# EAGLE design Myduino (EAGLE 7.2.0)
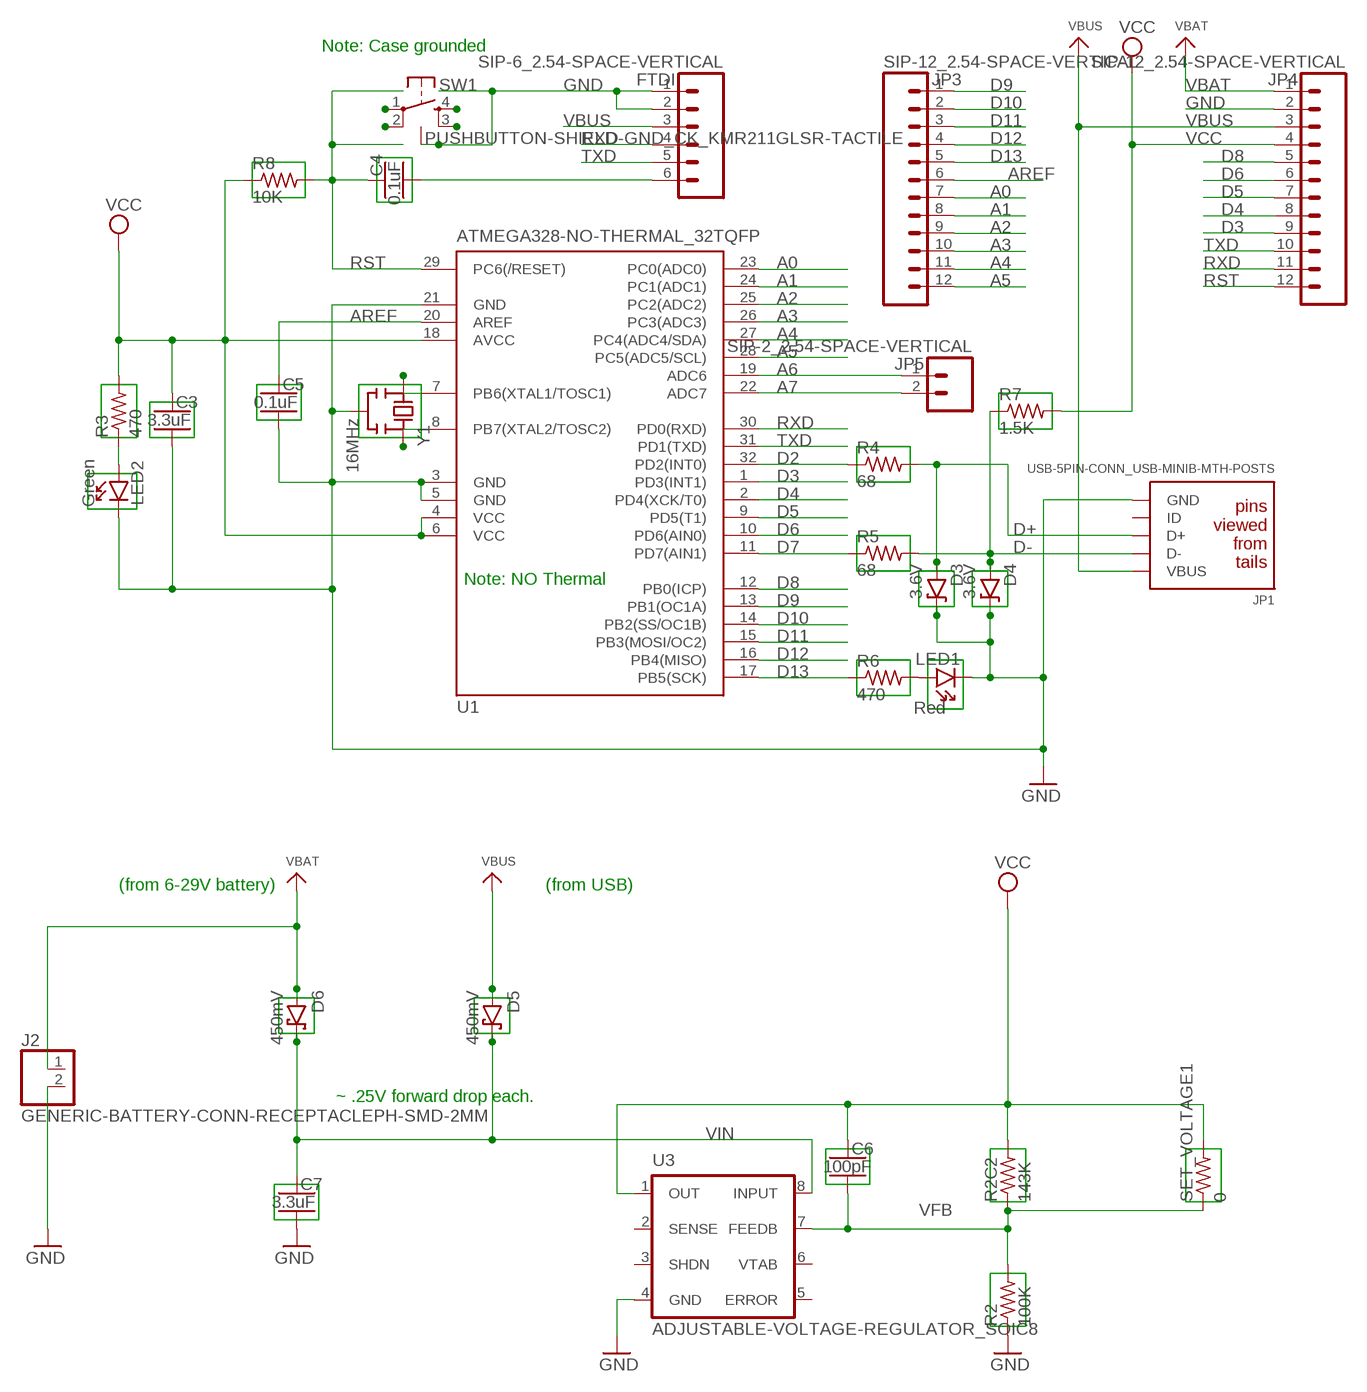
[diagram p0: schematic, sheet 1]

## Parts
C3  3.3uF  RESOLVED-CAPACITOR-NP_SMD-2012-0805_CERAMIC  [CAPC2012X140_HS]
C4  0.1uF  RESOLVED-CAPACITOR-NP_TH-FK26_CERAMIC  [CAPRB500W53L600T350H600_HS]
C5  0.1uF  RESOLVED-CAPACITOR-NP_TH-FK26_CERAMIC  [CAPRB500W53L600T350H600_HS]
C6  100pF  RESOLVED-CAPACITOR-NP_TH-FK24-FK28_CERAMIC  [CAPRB500W53L550T250H550_HS]
C7  3.3uF  RESOLVED-CAPACITOR-NP_SMD-2012-0805_CERAMIC  [CAPC2012X140_HS]
D3  3.6V  RESOLVED-DIODE-ZENER_TH-T18  [DIOAD1660W102L890D370_HS]
D4  3.6V  RESOLVED-DIODE-ZENER_TH-T18  [DIOAD1660W102L890D370_HS]
D5  450mV  RESOLVED-DIODE-SCHOTTKY_TH-DO-41-AND-DO-204AL  [DIOAD1125W78L520D270_HS]
D6  450mV  RESOLVED-DIODE-SCHOTTKY_TH-DO-41-AND-DO-204AL  [DIOAD1125W78L520D270_HS]
FTDI  SIP-6_2.54-SPACE-VERTICAL  [HDRV6W63P254_6X1_1524X254H838]
J2  GENERIC-BATTERY-CONN-RECEPTACLEPH-SMD-2MM  [JST_S2B-PH-SM4-TB]
JP1  USB-5PIN-CONN_USB-MINIB-MTH-POSTS  [FCI_10033526]
JP3  SIP-12_2.54-SPACE-VERTICAL  [HDRV12W63P254_12X1_3048X254H838]
JP4  SIP-12_2.54-SPACE-VERTICAL  [HDRV12W63P254_12X1_3048X254H838]
JP5  SIP-2_2.54-SPACE-VERTICAL  [HDRV2W63P254_2X1_508X254H838]
LED1  Red  RESOLVED-DIODE-LED_TH-ROHM-4X6-ROUND  [LEDRD250W50D400H640_HS]
LED2  Green  RESOLVED-DIODE-LED_TH-ROHM-4X6-ROUND  [LEDRD250W50D400H640_HS]
R2  100K  RESOLVED-RESISTOR_TH-1/4W-CARBON  [RESAD1160W55L680D260_HS]
R2C2  143K  RESOLVED-RESISTOR_TH-1/4W-CARBON  [RESAD1160W55L680D260_HS]
R3  470  RESOLVED-RESISTOR_TH-1/6W-CARBON  [RESAD770W45L370D210_HS]
R4  68  RESOLVED-RESISTOR_TH-1/6W-CARBON  [RESAD770W45L370D210_HS]
R5  68  RESOLVED-RESISTOR_TH-1/6W-CARBON  [RESAD770W45L370D210_HS]
R6  470  RESOLVED-RESISTOR_TH-1/6W-CARBON  [RESAD770W45L370D210_HS]
R7  1.5K  RESOLVED-RESISTOR_TH-1/6W-CARBON  [RESAD770W45L370D210_HS]
R8  10K  RESOLVED-RESISTOR_TH-1/6W-CARBON  [RESAD770W45L370D210_HS]
SET_VOLTAGE1  0  RESOLVED-RESISTOR_TH-1/6W-CARBON  [RESAD770W45L370D210_HS]
SW1  PUSHBUTTON-SHIELD-GND_CK_KMR211GLSR-TACTILE  [CK_KMR211GLSR]
U1  ATMEGA328-NO-THERMAL_32TQFP  [QFP80P900X900X120-32L30HS]
U3  ADJUSTABLE-VOLTAGE-REGULATOR_SOIC8  [SOIC127P600X175-8L86HS]
Y1  16MHz  RESOLVED-RESONATOR_TH-CTS8-X  [MURATA_CTLS8_X_SERIES_HS]

## Nets
A0: JP3.7 U1.23(PC0(ADC0))
A1: JP3.8 U1.24(PC1(ADC1))
A2: JP3.9 U1.25(PC2(ADC2))
A3: JP3.10 U1.26(PC3(ADC3))
A4: JP3.11 U1.27(PC4(ADC4/SDA))
A5: JP3.12 U1.28(PC5(ADC5/SCL))
A6: JP5.1 U1.19(ADC6)
A7: JP5.2 U1.22(ADC7)
AREF: C5.1 JP3.6 U1.20(AREF)
D2: R4.1 U1.32(PD2(INT0))
D3: JP4.9 U1.1(PD3(INT1))
D4: JP4.8 U1.2(PD4(XCK/T0))
D5: JP4.7 U1.9(PD5(T1))
D6: JP4.6 U1.10(PD6(AIN0))
D7: R5.1 U1.11(PD7(AIN1))
D8: JP4.5 U1.12(PB0(ICP))
D9: JP3.1 U1.13(PB1(OC1A))
D10: JP3.2 U1.14(PB2(SS/OC1B))
D11: JP3.3 U1.15(PB3(MOSI/OC2))
D12: JP3.4 U1.16(PB4(MISO))
D13: JP3.5 R6.1 U1.17(PB5(SCK))
D+: D3.A JP1.3(D+) R4.2
D-: D4.A JP1.2(D-) R5.2 R7.1
DTR/RTS: C4.2 FTDI.6
GND: C3.2 C5.2 C7.2 D3.C D4.C FTDI.1 FTDI.2 J2.2 JP1.5(GND) JP4.2 LED1.C LED2.C R2.1 SW1.1 SW1.4 SW1.5 U1.3(GND) U1.5(GND) U1.21(GND) U3.4(GND) Y1.2(GND)
N$2: LED1.A R6.2
N$4: U1.8(PB7(XTAL2/TOSC2)) Y1.1(OSC2)
N$5: U1.7(PB6(XTAL1/TOSC1)) Y1.3(OSC1)
N$6: LED2.A R3.1
RST: C4.1 JP4.12 R8.2 SW1.2 SW1.3 U1.29(PC6(/RESET))
RXD: FTDI.4 JP4.11 U1.30(PD0(RXD))
TXD: FTDI.5 JP4.10 U1.31(PD1(TXD))
VBAT: D6.A J2.1 JP4.1
VBUS: D5.A FTDI.3 JP1.1(VBUS) JP4.3
VCC: C3.1 C6.1 JP4.4 R2C2.2 R3.2 R7.2 R8.1 SET_VOLTAGE1.2 U1.4(VCC) U1.6(VCC) U1.18(AVCC) U3.1(OUT)
VFB: C6.2 R2.2 R2C2.1 SET_VOLTAGE1.1 U3.7(FEEDB)
VIN: C7.1 D5.C D6.C U3.8(INPUT)
Unconnected: JP1.4(ID) U3.2(SENSE) U3.3(SHDN) U3.5(ERROR) U3.6(VTAB)

## Notes on the sheet
- Note: Case grounded
- Note: NO Thermal
- (from 6-29V battery) | (from USB)
- ~ .25V forward drop each.

## Library data of the parts
C3 C7 = KoalaBuild:RESOLVED-CAPACITOR-NP_; VALUE_QUERY: 3.3uF; VOLTS: 35V; VOLTS_QUERY: 35V
C4 C5 = KoalaBuild:RESOLVED-CAPACITOR-NP_; VALUE_QUERY: 0.1uF
C6 = KoalaBuild:RESOLVED-CAPACITOR-NP_; VALUE_QUERY: 100pF
D3 D4 = KoalaBuild:RESOLVED-DIODE-ZENER_; VALUE_QUERY: 3.6
D5 D6 = KoalaBuild:RESOLVED-DIODE-SCHOTTKY_; VALUE_QUERY: <0.500V
FTDI = NVSL:SIP-6_; BREAKAWAY: 6 position; DIST1: DigiKey; DIST1PN: SAM1035-50-ND; MFR: Samtec; MPN: TSW-150-07-T-S
J2 = NVSL:GENERIC-BATTERY-CONN-RECEPTACLE; DIST1: DigiKey; DIST1PN: 455-1749-2-ND; MFR: JST; MPN: S2B-PH-SM4-TB(LF)(SN)
JP1 = NVSL:USB-5PIN-CONN_; DIST1: DigiKey; DIST1PN: 609-4701-1-ND; MFR: FCI; MPN: 10033526-N3212MLF
JP3 = NVSL:SIP-12_; BREAKAWAY: 12 position; DIST1: DigiKey; DSIST-1-PN: SAM1035-50-ND; MFR: Samtec; MPN: TSW-150-07-T-S
JP4 = NVSL:SIP-12_; BREAKAWAY: 12 position; DIST1: DigiKey; DIST1PN: SAM1035-50-ND; MFR: Samtec; MPN: TSW-150-07-T-S
JP5 = NVSL:SIP-2_; BREAKAWAY: 2 position; DIST1: DigiKey; DIST1PN: SAM1035-50-ND; MFR: Samtec; MPN: TSW-150-07-T-S
LED1 = KoalaBuild:RESOLVED-DIODE-LED_; VALUE_QUERY: Red
LED2 = KoalaBuild:RESOLVED-DIODE-LED_; VALUE_QUERY: Green
R2 = KoalaBuild:RESOLVED-RESISTOR_; TOL: 1%; TOL_QUERY: 1%; VALUE_QUERY: 100K
R2C2 = KoalaBuild:RESOLVED-RESISTOR_; TOL: 1%; TOL_QUERY: 1%; VALUE_QUERY: 143K
R3 R6 = KoalaBuild:RESOLVED-RESISTOR_; VALUE_QUERY: 470
R4 R5 = KoalaBuild:RESOLVED-RESISTOR_; VALUE_QUERY: 68
R7 = KoalaBuild:RESOLVED-RESISTOR_; VALUE_QUERY: 1.5K
R8 = KoalaBuild:RESOLVED-RESISTOR_; VALUE_QUERY: 10K
SET_VOLTAGE1 = KoalaBuild:RESOLVED-RESISTOR_; TOL: 1%; TOL_QUERY: 1%
SW1 = NVSL:PUSHBUTTON-SHIELD-GND_; DIST1: DigiKey; DIST1PN: 401-1426-1-ND; MFR: C&K; MPN: KMR211GLFS
U1 = NVSL:ATMEGA328-NO-THERMAL_; DIST1: DigiKey; DIST1PN: ATMEGA328-AU-ND; MFR: Atmel; MPN: ATMEGA328-AU
U3 = NVSL:ADJUSTABLE-VOLTAGE-REGULATOR_; DIST1: DigiKey; DIST1PN: 576-1149-1-ND; IFWD: 150ma; MFR: Micrel; MPN: MIC2951-03YM; VFWD: 0.3V
Y1 = KoalaBuild:RESOLVED-RESONATOR_; CAP: 15pF; STBL: 0.002; VALUE_QUERY: 16 MHz

## Net classes
1 power: width 0.305 mm

## Board
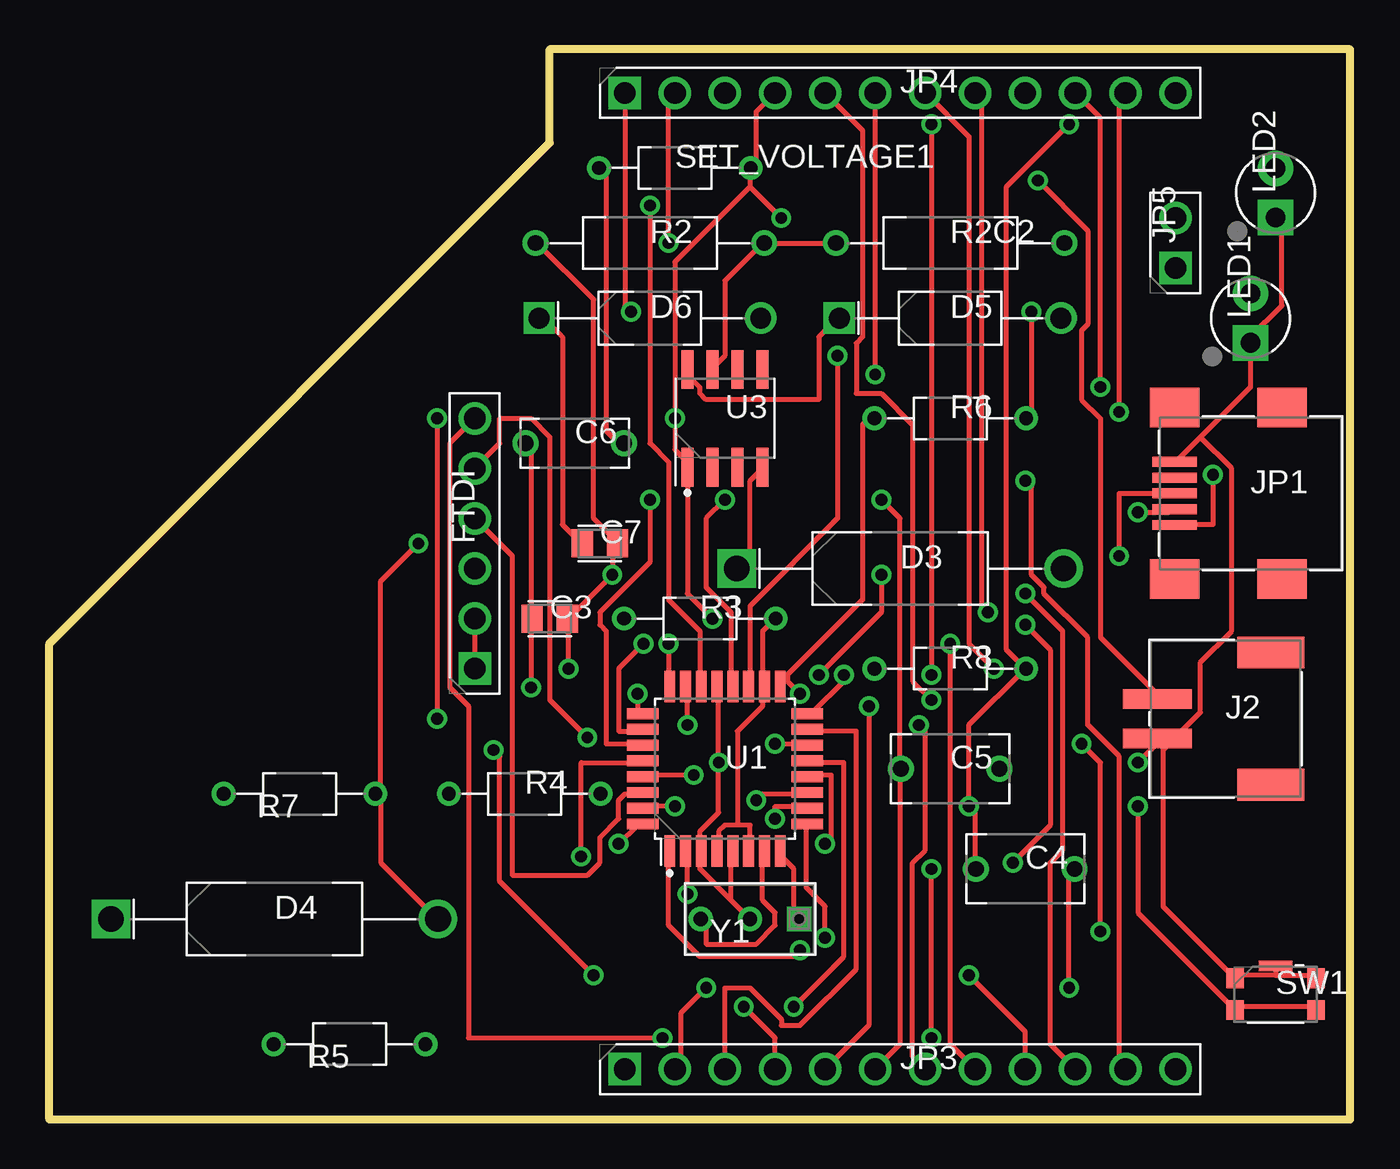
[diagram p1: board, top side]
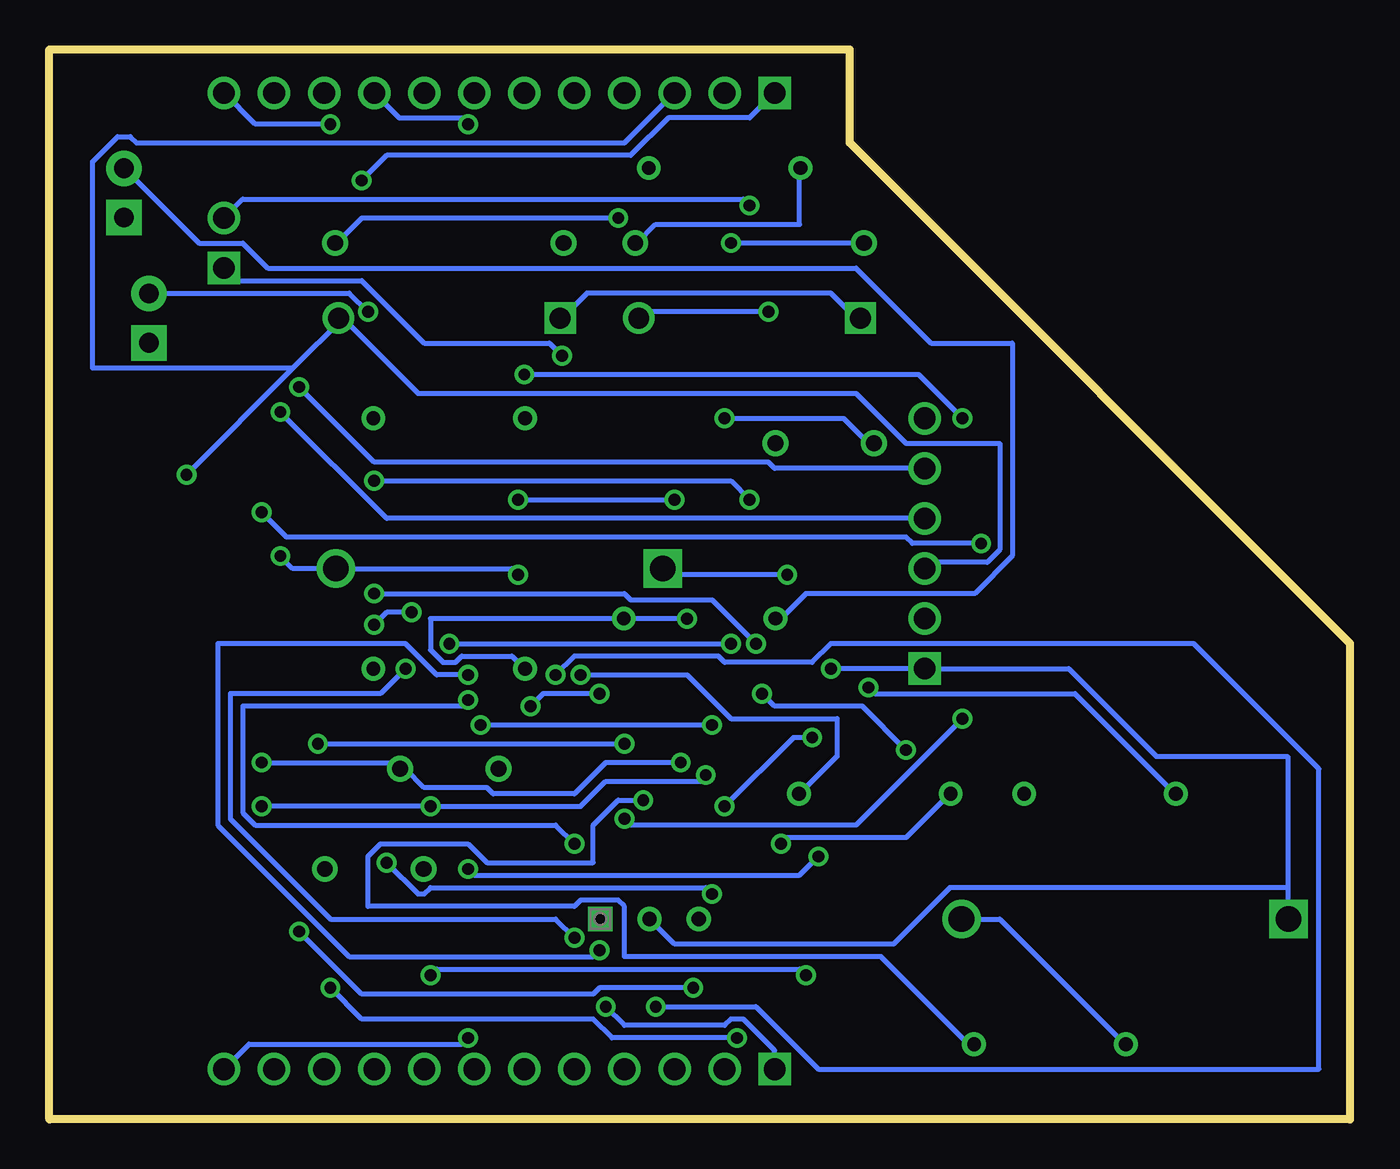
[diagram p2: board, bottom side, seen from below]

Size 66.02 x 54.28 mm. Coordinates in mm from the lower left corner, seen from the top.
Outline: 0,0 66.02,0 66.02,54.28 25.4,54.28 25.4,49.53 0,24.13 0,0
Copper layers (1*16): Top 0.035mm / dielectric 1.5mm / Bottom 0.035mm
Design rules "default": minimum track width 10mil, minimum drill 0.6mm, track to track 8mil, track to pad 8mil, pad to pad 8mil, via to via 8mil, smd to smd 8mil, copper to edge 40mil, drill to drill 8mil, minimum pad ring 10mil, minimum via ring 8mil, stop-mask expansion 4mil, vias tented up to drill 0mil, thermal gap 10mil

### Footprints (pad centres in the part's own frame; a part is rotated, then mirrored left to right if it is on the bottom)
CAPC2012X140_HS = smd 1.08 x 1.42: 1 -0.895,0; 2 0.895,0
CAPRB500W53L600T350H600_HS = drill 0.8 pad 1.2: 1 -2.5,0; 2 2.5,0
CAPRB500W53L550T250H550_HS = drill 0.8 pad 1.2: 1 -2.5,0; 2 2.5,0
DIOAD1660W102L890D370_HS = drill 1.3 pad 1.95: A 8.3,0 | drill 1.3 pad 1.95 square: C -8.3,0
DIOAD1125W78L520D270_HS = drill 1.06 pad 1.59: A 5.625,0 | drill 1.06 pad 1.59 square: C -5.625,0
HDRV6W63P254_6X1_1524X254H838 = drill 1.1 pad 1.65 square: 1 0,0 | drill 1.1 pad 1.65: 2 2.54,0; 3 5.08,0; 4 7.62,0; 5 10.16,0; 6 12.7,0
JST_S2B-PH-SM4-TB = smd 3.5 x 1: 1 -3.45,1; 2 -3.45,-1 | smd 3.4 x 1.6: 3 2.3,-3.35; 4 2.3,3.35
FCI_10033526 = smd 2.25 x 0.5: 1 -3.85,-1.6; 2 -3.85,-0.8; 3 -3.85,0; 4 -3.85,0.8; 5 -3.85,1.6 | smd 2.5 x 2: 6 -3.85,4.35; 7 1.6,4.35; 8 1.6,-4.35; 9 -3.85,-4.35
HDRV12W63P254_12X1_3048X254H838 = drill 1.1 pad 1.65 square: 1 0,0 | drill 1.1 pad 1.65: 2 2.54,0; 3 5.08,0; 4 7.62,0; 5 10.16,0; 6 12.7,0; 7 15.24,0; 8 17.78,0; 9 20.32,0; 10 22.86,0; 11 25.4,0; 12 27.94,0
HDRV2W63P254_2X1_508X254H838 = drill 1.1 pad 1.65 square: 1 0,0 | drill 1.1 pad 1.65: 2 2.54,0
LEDRD250W50D400H640_HS = drill 1 pad 1.8: A 1.25,0 | drill 1 pad 1.8 square: C -1.25,0
RESAD1160W55L680D260_HS = drill 0.8 pad 1.2: 1 -5.8,0; 2 5.8,0
RESAD770W45L370D210_HS = drill 0.7 pad 1.05: 1 -3.85,0; 2 3.85,0
CK_KMR211GLSR = smd 0.9 x 1: 1 -2.05,0.8; 2 -2.05,-0.8; 3 2.05,-0.8; 4 2.05,0.8 | smd 1.7 x 0.55: 5 0,1.425
QFP80P900X900X120-32L30HS = smd 0.55 x 1.6: 1 -2.8,-4.18; 2 -2,-4.18; 3 -1.2,-4.18; 4 -0.4,-4.18; 5 0.4,-4.18; 6 1.2,-4.18; 7 2,-4.18; 8 2.8,-4.18; 17 2.8,4.18; 18 2,4.18; 19 1.2,4.18; 20 0.4,4.18; 21 -0.4,4.18; 22 -1.2,4.18; 23 -2,4.18; 24 -2.8,4.18 | smd 1.6 x 0.55: 9 4.18,-2.8; 10 4.18,-2; 11 4.18,-1.2; 12 4.18,-0.4; 13 4.18,0.4; 14 4.18,1.2; 15 4.18,2; 16 4.18,2.8; 25 -4.18,2.8; 26 -4.18,2; 27 -4.18,1.2; 28 -4.18,0.4; 29 -4.18,-0.4; 30 -4.18,-1.2; 31 -4.18,-2; 32 -4.18,-2.8
SOIC127P600X175-8L86HS = smd 0.6 x 1.97: 1 -1.905,-2.475; 2 -0.635,-2.475; 3 0.635,-2.475; 4 1.905,-2.475; 5 1.905,2.475; 6 0.635,2.475; 7 -0.635,2.475; 8 -1.905,2.475
MURATA_CTLS8_X_SERIES_HS = drill 0.73 pad 1.1 square: 1 -2.5,0 | drill 0.73 pad 1.1: 2 0,0; 3 2.5,0

### Placement (x,y rotation side)
C3  25.4,25.4 0 top
C4  49.53,12.7 0 top
C5  45.72,17.78 0 top
C6  26.67,34.29 0 top
C7  27.94,29.21 0 top
D3  43.18,27.94 0 top
D4  11.43,10.16 0 top
D5  45.72,40.64 0 top
D6  30.48,40.64 0 top
FTDI  21.59,22.86 90 top
J2  59.69,20.32 0 top
JP1  60.96,31.75 0 top
JP3  29.21,2.54 0 top
JP4  29.21,52.07 0 top
JP5  57.15,43.18 90 top
LED1  60.96,40.64 90 top
LED2  62.23,46.99 90 top
R2  30.48,44.45 0 top
R2C2  45.72,44.45 0 top
R3  33.02,25.4 0 top
R4  24.13,16.51 0 top
R5  15.24,3.81 180 top
R6  45.72,35.56 0 top
R7  12.7,16.51 180 top
R8  45.72,22.86 0 top
SET_VOLTAGE1  31.75,48.26 0 top
SW1  62.23,6.35 0 top
U1  34.29,17.78 0 top
U3  34.29,35.56 0 top
Y1  35.56,10.16 180 top

### Tracks (layer width: path | path; a pad name or v marks a point on that pad's centre or on a via)
A0  (via drill 0.6)
  Top 0.254: v32.39,20 32.39,21.91 U1.23 | v44.13,20 44.45,19.68 44.45,13.65 43.81,13.02 43.81,3.17 JP3.7
  Bottom 0.254: v44.13,20 v32.39,20
A1  (via drill 0.6)
  Top 0.254: v31.43,24.13 31.43,22.22 U1.24 | v45.72,24.13 45.72,3.81 JP3.8
  Bottom 0.254: v45.72,24.13 v31.43,24.13
A2  (via drill 0.6)
  Top 0.254: v29.84,21.59 29.84,20.64 U1.25 | v22.54,18.73 22.86,18.41 22.86,12.06 v27.62,7.3 | v46.67,7.3 49.53,4.45 JP3.9
  Bottom 0.254: v29.84,21.59 29.21,20.95 24.77,20.95 v22.54,18.73 | v27.62,7.3 27.94,7.62 46.36,7.62 v46.67,7.3
A3  (via drill 0.6)
  Top 0.254: v30.16,24.13 28.89,22.86 28.89,19.68 29.84,19.68 U1.26 | v49.53,26.67 51.44,24.77 51.44,13.65 50.8,13.02 50.8,3.81 JP3.10
  Bottom 0.254: v30.16,24.13 32.39,26.35 36.51,26.35 36.83,26.67 v49.53,26.67
A4  (via drill 0.6)
  Top 0.254: v30.48,31.43 30.48,28.26 27.94,25.72 27.94,25.08 28.26,24.77 28.26,19.05 29.84,19.05 U1.27 | v49.53,32.38 49.85,32.07 49.85,27.62 50.48,26.99 50.48,26.67 52.7,24.45 52.7,20 54.29,18.41 54.29,2.86 JP3.11
  Bottom 0.254: v30.48,31.43 31.43,32.38 v49.53,32.38
A5  (via drill 0.6)
  Top 0.254: v26.99,13.34 26.99,18.1 29.84,18.1 U1.28 | v44.77,4.13 v44.77,12.7
  Bottom 0.254: v26.99,13.34 27.94,12.38 44.45,12.38 v44.77,12.7 | v44.77,4.13 45.09,3.81 55.88,3.81 JP3.12
A6  (via drill 0.6)
  Top 0.254: v40.01,38.73 40.01,30.48 35.56,26.03 35.56,22.22 U1.19
  Bottom 0.254: v40.01,38.73 40.64,39.37 46.99,39.37 50.17,42.55 56.52,42.55 JP5.1
A7  (via drill 0.6)
  Top 0.254: v30.48,46.36 30.48,34.29 31.43,33.34 31.43,26.35 33.02,24.77 33.02,22.22 U1.22
  Bottom 0.254: v30.48,46.36 30.8,46.67 56.2,46.67 JP5.2
AREF  (via drill 0.6)
  Top 0.254: v34.29,31.43 33.34,30.48 33.34,26.99 34.61,25.72 34.61,22.22 U1.20 | v42.23,31.43 43.18,30.48 43.18,17.78 | JP3.6 43.18,3.81 43.18,17.78 | 43.18,17.78 C5.1
  Bottom 0.254: v42.23,31.43 v34.29,31.43
D2  (via drill 0.6)
  Top 0.254: v28.89,13.97 29.84,14.92 U1.32
  Bottom 0.254: v28.89,13.97 28.58,14.29 22.54,14.29 20.32,16.51 R4.1
D3  (via drill 0.6)
  Top 0.254: v38.1,8.57 38.1,8.25 33.02,8.25 31.43,9.84 31.43,13.34 U1.1 | v44.77,50.48 v44.77,22.54
  Bottom 0.254: v38.1,8.57 38.42,8.25 50.8,8.25 57.47,14.92 57.47,24.13 47.94,24.13 46.36,22.54 v44.77,22.54 | v44.77,50.48 45.09,50.8 48.26,50.8 JP4.9
D4  (via drill 0.6)
  Top 0.254: v32.39,11.43 32.39,13.34 U1.2 | v48.89,13.02 50.8,14.92 50.8,23.81 v49.53,25.08 | v47.62,25.72 47.31,26.03 47.31,51.75 JP4.8
  Bottom 0.254: v32.39,11.43 32.7,11.75 46.67,11.75 46.99,11.43 47.31,11.43 v48.89,13.02 | v49.53,25.08 48.89,25.72 v47.62,25.72
D5  (via drill 0.6)
  Top 0.254: v39.37,9.21 39.37,10.79 38.42,11.75 38.42,14.92 U1.9 | v47.94,22.86 46.67,24.13 46.67,49.85 JP4.7
  Bottom 0.254: v39.37,9.21 40.32,10.16 51.75,10.16 56.83,15.24 56.83,21.59 49.21,21.59 v47.94,22.86
D6  (via drill 0.6)
  Top 0.254: v36.83,15.24 36.83,15.88 38.42,15.88 U1.10 | v19.69,35.56 v19.69,20.32 | JP4.6 v41.91,37.78
  Bottom 0.254: v36.83,15.24 36.51,14.92 25.08,14.92 v19.69,20.32 | v19.69,35.56 21.91,37.78 v41.91,37.78
D7  (via drill 0.6)
  Top 0.254: v35.88,16.19 35.88,16.51 38.42,16.51 U1.11
  Bottom 0.254: v35.88,16.19 37.15,16.19 38.42,14.92 38.42,13.02 43.81,13.02 44.77,13.97 49.21,13.97 49.85,13.34 49.85,10.79 39.37,10.79 39.05,11.11 37.15,11.11 36.83,10.79 36.83,8.25 23.81,8.25 19.37,3.81 R5.1
D8  (via drill 0.6)
  Top 0.254: v39.37,13.97 39.69,14.29 39.69,17.46 38.73,17.46 U1.12 | v44.77,21.27 43.81,22.22 43.81,35.24 42.23,36.83 40.96,36.83 40.96,39.37 41.28,39.69 41.28,50.16 JP4.5
  Bottom 0.254: v39.37,13.97 40.32,14.92 55.56,14.92 56.2,15.56 56.2,20.95 45.09,20.95 v44.77,21.27
D9  (via drill 0.6)
  Top 0.254: v37.78,5.71 40.32,8.25 40.32,18.1 38.73,18.1 U1.13
  Bottom 0.254: v37.78,5.71 36.83,4.76 31.75,4.76 31.43,5.08 30.8,5.08 29.21,3.49 JP3.1
D10  (via drill 0.6)
  Top 0.254: v36.83,19.05 38.42,19.05 U1.14 | v52.39,19.05 53.34,18.1 v53.34,9.52 | v33.34,6.67 32.07,5.4 32.07,2.86 JP3.2
  Bottom 0.254: v52.39,19.05 v36.83,19.05 | v53.34,9.52 50.17,6.35 38.42,6.35 38.1,6.67 v33.34,6.67
D11
  Top 0.254: JP3.3 34.29,6.67 35.56,6.67 37.15,5.08 37.15,4.76 38.1,4.76 40.96,7.62 40.96,19.68 38.73,19.68 U1.15
D12  (via drill 0.6)
  Top 0.254: v40.32,22.54 40.32,22.22 38.73,20.64 U1.16 | v35.24,5.71 36.83,4.13 JP3.4
  Bottom 0.254: v40.32,22.54 39.37,23.49 32.07,23.49 31.75,23.18 27.31,23.18 26.35,24.13 7.94,24.13 1.59,17.78 1.59,2.54 26.99,2.54 30.16,5.71 v35.24,5.71
D13  (via drill 0.6)
  Top 0.254: 37.47,22.54 41.28,26.35 41.28,35.24 41.59,35.56 R6.1 | 37.47,22.54 37.15,22.22 U1.17 | JP3.5 41.59,4.76 v41.59,20.95 | v38.1,21.59 37.47,22.22 37.47,22.54
  Bottom 0.254: v41.59,20.95 40.96,21.59 v38.1,21.59
D+  (via drill 0.6)
  Top 0.254: JP1.3 54.29,31.75 v54.29,28.58 | v39.05,22.54 42.23,25.72 v42.23,27.62
  Bottom 0.254: v54.29,28.58 53.66,27.94 D3.A 42.55,27.94 v42.23,27.62 | v39.05,22.54 33.66,22.54 31.43,20.32 26.03,20.32 26.03,18.41 27.94,16.51 R4.2
D-  (via drill 0.6)
  Top 0.254: v55.25,30.8 56.83,30.8 JP1.2 | v18.73,29.21 16.83,27.3 16.83,16.51 | 16.83,16.51 16.83,13.02 19.69,10.16 D4.A | 16.83,16.51 R7.1
  Bottom 0.254: D4.A 17.78,10.16 11.43,3.81 R5.2 | v55.25,30.8 53.98,29.53 22.54,29.53 22.23,29.21 v18.73,29.21
DTR/RTS  (via drill 0.6)
  Top 0.254: v51.75,6.67 51.75,12.7 C4.2 | v31.12,4.13 21.27,4.13 21.27,20.95 20.32,21.91 20.32,34.29 FTDI.6
  Bottom 0.254: v51.75,6.67 50.17,5.08 38.42,5.08 37.47,4.13 v31.12,4.13
GND  (via drill 0.6)
  Top 0.254: 58.42,34.61 60.96,37.15 LED1.C 60.96,39.69 62.55,41.27 62.55,45.4 62.23,45.72 LED2.C | 58.42,34.61 57.15,33.34 JP1.5 | 62.23,7.3 60.33,7.3 SW1.1 60.01,7.3 56.52,10.79 56.52,18.73 | SW1.5 62.23,7.3 | 62.23,7.3 64.14,7.3 SW1.4 | v55.25,18.1 56.2,19.05 J2.2 56.52,19.05 56.52,18.73 | 58.42,34.61 60.01,33.02 60.01,24.77 58.42,23.18 58.42,20.64 56.52,18.73 | U3.4 36.2,33.02 35.56,32.38 35.56,28.58 34.92,27.94 D3.C | 26.35,25.4 v28.58,27.62 28.58,29.21 | 28.58,29.21 28.58,29.53 27.62,30.48 27.62,41.59 24.77,44.45 R2.1 | 28.58,29.21 C7.2 | JP4.2 31.43,51.75 v31.43,44.45 | Y1.2 34.61,11.11 | 34.61,11.11 33.02,12.7 33.02,13.34 U1.3 33.02,13.65 33.02,14.6 33.97,15.56 v33.97,18.1 33.97,21.91 U1.21 | 34.61,11.11 34.61,13.34 U1.5 | FTDI.2 FTDI.1 | v26.35,22.86 26.35,25.4 | 26.35,25.4 C3.2
  Bottom 0.254: v55.25,18.1 48.58,18.1 48.26,17.78 C5.2 47.94,17.78 46.99,16.83 43.81,16.83 43.5,16.51 39.37,16.51 37.78,18.1 v33.97,18.1 | R2.1 v31.43,44.45 | v28.58,27.62 34.29,27.62 34.61,27.94 D3.C | 3.18,11.75 3.18,18.41 9.84,18.41 14.29,22.86 FTDI.1 v26.35,22.86 | 3.18,11.75 3.18,10.16 D4.C | Y1.2 34.29,8.89 23.18,8.89 20.32,11.75 3.18,11.75
N$2  (via drill 0.6)
  Top 0.254: v49.85,40.96 49.85,35.56 R6.2
  Bottom 0.254: v49.85,40.96 50.8,41.91 60.96,41.91 LED1.A
N$4
  Top 0.254: U1.8 37.15,13.34 37.78,12.7 37.78,10.16 Y1.1
N$5
  Top 0.254: U1.7 36.2,13.34 36.2,11.11 36.83,10.48 36.83,9.84 35.88,8.89 33.34,8.89 33.34,10.16 Y1.3
N$6
  Bottom 0.254: R3.1 28.89,25.4 27.62,26.67 19.05,26.67 17.14,28.58 17.14,39.37 21.27,39.37 25.08,43.18 54.93,43.18 56.2,44.45 58.42,44.45 61.91,47.94 62.23,47.94 LED2.A
RST  (via drill 0.6)
  Top 0.254: SW1.3 64.14,5.71 60.33,5.71 SW1.2 60.01,5.71 55.25,10.48 v55.25,15.88 | v32.7,17.46 30.16,17.46 U1.29 | C4.1 46.99,12.7 46.99,15.56 v46.67,15.88 46.67,20 49.53,22.86 | v51.75,50.48 48.58,47.31 48.58,23.81 49.53,22.86 | 49.53,22.86 R8.2
  Bottom 0.254: v32.7,17.46 33.02,17.14 37.78,17.14 39.05,15.88 v46.67,15.88 v55.25,15.88 | JP4.12 55.56,50.48 v51.75,50.48
RXD  (via drill 0.6)
  Top 0.254: FTDI.4 23.5,28.58 23.5,12.38 27.31,12.38 27.94,13.02 27.94,14.29 28.89,15.24 28.89,16.19 29.21,16.51 29.84,16.51 U1.30 | JP4.11 54.29,51.75 v54.29,35.88
  Bottom 0.254: v54.29,35.88 48.89,30.48 FTDI.4
TXD  (via drill 0.6)
  Top 0.254: v31.75,15.88 30.16,15.88 U1.31 | v27.31,19.37 25.4,21.27 25.4,34.61 24.45,35.56 22.86,35.56 22.86,34.29 FTDI.5 | JP4.10 53.34,50.8 v53.34,37.15
  Bottom 0.254: v31.75,15.88 28.26,19.37 v27.31,19.37 | v53.34,37.15 49.53,33.34 29.53,33.34 29.21,33.02 FTDI.5
VBAT  (via drill 0.6)
  Top 0.254: v29.53,40.96 29.21,41.27 JP4.1 | v50.17,47.62 52.7,45.08 52.7,40.32 52.39,40 52.39,36.51 53.34,35.56 53.34,24.45 56.2,21.59 J2.1
  Bottom 0.254: v29.53,40.96 35.56,40.96 35.88,40.64 D6.A | v50.17,47.62 48.89,48.89 36.51,48.89 34.61,50.8 30.48,50.8 JP4.1
VBUS  (via drill 0.6)
  Top 0.254: v59.06,32.7 59.06,30.16 57.15,30.16 JP1.1
  Bottom 0.254: 51.12,40.64 53.66,38.1 | 53.66,38.1 v59.06,32.7 | FTDI.3 21.27,28.26 18.42,28.26 17.78,28.89 17.78,34.29 22.54,34.29 25.08,36.83 47.31,36.83 51.12,40.64 | 51.12,40.64 D5.A | JP4.3 36.83,49.53 61.59,49.53 61.91,49.85 62.55,49.85 63.82,48.58 63.82,38.1 53.66,38.1
VCC  (via drill 0.6)
  Top 0.254: 24.45,25.4 24.45,34.29 C6.1 | 24.45,25.4 v24.45,21.91 | 24.45,25.4 C3.1 | 34.92,14.92 35.56,14.92 35.56,13.65 U1.6 | 34.92,14.92 34.29,14.92 33.97,14.6 33.97,13.65 U1.4 | R3.2 36.83,25.4 36.2,24.77 36.2,22.22 U1.18 36.2,21.91 36.2,20.95 34.92,19.68 34.92,14.92 | 35.56,47.31 31.75,43.5 v31.75,35.56 31.75,33.97 32.39,33.34 U3.1 32.39,26.67 v33.66,25.4 | 35.56,47.31 35.56,48.26 SET_VOLTAGE1.2 35.88,48.26 35.88,51.12 JP4.4 | 35.56,47.31 v37.15,45.72
  Bottom 0.254: v24.45,21.91 24.13,21.59 13.97,21.59 8.89,16.51 R7.2 | R8.1 41.91,22.86 42.55,23.49 45.09,23.49 45.4,23.18 46.04,23.18 46.67,23.81 46.67,25.4 R3.2 v33.66,25.4 | v37.15,45.72 50.17,45.72 51.44,44.45 R2C2.2 | v31.75,35.56 25.72,35.56 24.45,34.29 C6.1
VFB
  Top 0.254: U3.7 33.66,38.1 34.29,38.73 34.29,42.55 36.2,44.45 R2.2 R2C2.1 | C6.2 28.89,34.29 28.26,34.92 28.26,47.94 27.94,48.26 SET_VOLTAGE1.1
  Bottom 0.254: SET_VOLTAGE1.1 27.94,48.26 27.94,45.4 35.24,45.4 36.2,44.45 R2.2
VIN
  Top 0.254: U3.8 32.39,37.78 33.02,37.15 33.02,36.83 33.34,36.51 39.05,36.51 39.05,39.69 40.01,40.64 D5.C | C7.1 26.99,29.21 26.03,30.16 26.03,39.69 25.08,40.64 D6.C
  Bottom 0.254: D5.C 40.01,40.64 38.73,41.91 26.35,41.91 25.08,40.64 D6.C